# Altium project VeloServo.PrjPcb
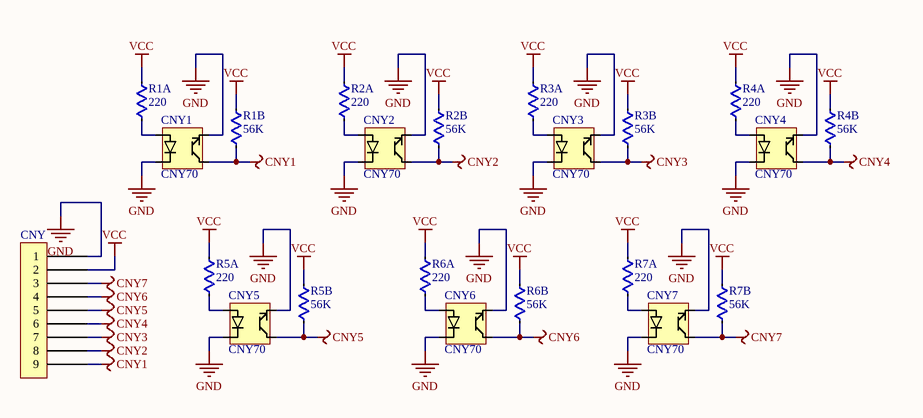
[diagram p0: sensores.SchDoc]
2 sheets, 39 parts. Net scope: global (net labels, ports and power ports of the same name join across sheets).
Board files: sensores.PcbDoc, main.PcbDoc
Sheets:
  sensores.SchDoc
  main.SchDoc

## Sheet sensores.SchDoc
size A4

### Parts
(Parts that share a designator on the sheet are numbered #1, #2 ... from top to bottom, then left to right.)
CNY1  CNY70  [CNY70]
CNY2  CNY70  [CNY70]
CNY3  CNY70  [CNY70]
CNY4  CNY70  [CNY70]
CNY5  CNY70  [CNY70]
CNY6  CNY70  [CNY70]
CNY7  CNY70  [CNY70]
CNY#1  (no value)  [HEADER 1x9]
R1A  value 220  [RES-Axial-400mil]
R1B  value 56K  [RES-Axial-400mil]
R2A  value 220  [RES-Axial-400mil]
R2B  value 56K  [RES-Axial-400mil]
R3A  value 220  [RES-Axial-400mil]
R3B  value 56K  [RES-Axial-400mil]
R4A  value 220  [RES-Axial-400mil]
R4B  value 56K  [RES-Axial-400mil]
R5A  value 220  [RES-Axial-400mil]
R5B  value 56K  [RES-Axial-400mil]
R6A  value 220  [RES-Axial-400mil]
R6B  value 56K  [RES-Axial-400mil]
R7A  value 220  [RES-Axial-400mil]
R7B  value 56K  [RES-Axial-400mil]

### Nets
CNY1: CNY1.C CNY#1.9 R1B.1
CNY2: CNY2.C CNY#1.8 R2B.1
CNY3: CNY3.C CNY#1.7 R3B.1
CNY4: CNY4.C CNY#1.6 R4B.1
CNY5: CNY5.C CNY#1.5 R5B.1
CNY6: CNY6.C CNY#1.4 R6B.1
CNY7: CNY7.C CNY#1.3 R7B.1
GND: CNY1.E(7.5) CNY1.K CNY2.E(7.5) CNY2.K CNY3.E(7.5) CNY3.K CNY4.E(7.5) CNY4.K CNY5.E(7.5) CNY5.K CNY6.E(7.5) CNY6.K CNY7.E(7.5) CNY7.K CNY#1.1
VCC: CNY#1.2 R1A.1 R1B.2 R2A.1 R2B.2 R3A.1 R3B.2 R4A.1 R4B.2 R5A.1 R5B.2 R6A.1 R6B.2 R7A.1 R7B.2
NetCNY1_A: CNY1.A R1A.2
NetCNY2_A: CNY2.A R2A.2
NetCNY3_A: CNY3.A R3A.2
NetCNY4_A: CNY4.A R4A.2
NetCNY5_A: CNY5.A R5A.2
NetCNY6_A: CNY6.A R6A.2
NetCNY7_A: CNY7.A R7A.2

### Library data of the parts
CNY#1 = Header 1x9
R1A R1B R2A R2B R3A R3B R4A R4B R5A R5B R6A R6B R7A R7B = RES

## Sheet main.SchDoc
size A4
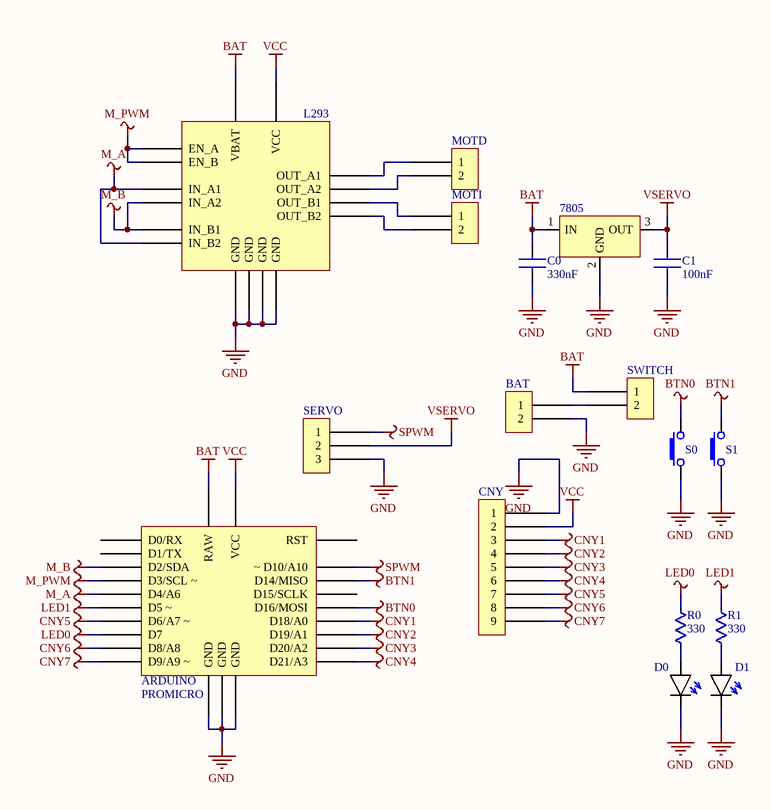
[diagram p1: main.SchDoc]

### Parts
(Parts that share a designator on the sheet are numbered #1, #2 ... from top to bottom, then left to right.)
7805  LM78XX  [TO-220-STRAIGHT]  (value not drawn)
ARDUINO  PROMICRO  [PROMICRO]
BAT  (no value)  [HEADER 1x2]
C0  value 330nF  [CAP-CER]  (hidden comment: CAP-CER)
C1  value 100nF  [CAP-CER]  (hidden comment: CAP-CER)
CNY#2  (no value)  [HEADER 1x9]
D0  LED  [LED-3MM-RED]  (value not drawn)
D1  LED  [LED-3MM-GREEN]  (value not drawn)
L293  L293  [DIP16]  (value not drawn)
MOTD  (no value)  [HEADER 1x2]
MOTI  (no value)  [HEADER 1x2]
R0  value 330  [RES-Axial-400mil]  (hidden comment: RES)
R1  value 330  [RES-Axial-400mil]  (hidden comment: RES)
S0  BUTTON_SMALL_4PIN  [TACT_SWITCH-SMALL-4PIN]  (value not drawn)
S1  BUTTON_SMALL_4PIN  [TACT_SWITCH-SMALL-4PIN]  (value not drawn)
SERVO  (no value)  [Header 1x3]
SWITCH  (no value)  [HEADER 1x2]

### Nets
BAT: 7805.1(IN) ARDUINO.13(RAW) C0.2 L293.16(VBAT) SWITCH.1
BTN0: ARDUINO.23(D16/MOSI) S0.2
BTN1: ARDUINO.22(D14/MISO) S1.2
CNY1: ARDUINO.20(D18/A0) CNY#2.3
CNY2: ARDUINO.19(D19/A1) CNY#2.4
CNY3: ARDUINO.18(D20/A2) CNY#2.5
CNY4: ARDUINO.17(D21/A3) CNY#2.6
CNY5: ARDUINO.4(D6/A7_~) CNY#2.7
CNY6: ARDUINO.2(D8/A8) CNY#2.8
CNY7: ARDUINO.1(D9/A9_~) CNY#2.9
GND: 7805.2(GND) ARDUINO.9(GND) ARDUINO.10(GND) ARDUINO.14(GND) BAT.2 C0.1 C1.2 CNY#2.1 D0.K D1.K L293.4(GND) L293.5(GND) L293.12(GND) L293.13(GND) S0.1 S1.1 SERVO.3
LED0: ARDUINO.3(D7) R0.2
LED1: ARDUINO.5(D5_~) R1.2
M_A: ARDUINO.6(D4/A6) L293.2(IN_A1) L293.15(IN_B2)
M_B: ARDUINO.8(D2/SDA) L293.7(IN_A2) L293.10(IN_B1)
M_PWM: ARDUINO.7(D3/SCL_~) L293.1(EN_A) L293.9(EN_B)
SPWM: ARDUINO.24(~_D10/A10) SERVO.1
VCC: ARDUINO.16(VCC) CNY#2.2 L293.8(VCC)
VSERVO: 7805.3(OUT) C1.1 SERVO.2
NetBAT_1: BAT.1 SWITCH.2
NetD0_A: D0.A R0.1
NetD1_A: D1.A R1.1
NetL293_3: L293.3(OUT_A1) MOTD.1
NetL293_6: L293.6(OUT_A2) MOTD.2
NetL293_11: L293.11(OUT_B1) MOTI.1
NetL293_14: L293.14(OUT_B2) MOTI.2

Not connected (* = marked no-connect by the designer): ARDUINO 11(D0/RX) 12(D1/TX) 15(RST) 21(D15/SCLK)

### Library data of the parts
BAT MOTD MOTI SWITCH = Header 1x2
CNY#2 = Header 1x9
SERVO = Header 1x3

## Nets that join several sheets
CNY1: sensores (CNY1.C CNY#1.9 R1B.1), main (ARDUINO.20 CNY#2.3)
CNY2: sensores (CNY2.C CNY#1.8 R2B.1), main (ARDUINO.19 CNY#2.4)
CNY3: sensores (CNY3.C CNY#1.7 R3B.1), main (ARDUINO.18 CNY#2.5)
CNY4: sensores (CNY4.C CNY#1.6 R4B.1), main (ARDUINO.17 CNY#2.6)
CNY5: sensores (CNY5.C CNY#1.5 R5B.1), main (ARDUINO.4 CNY#2.7)
CNY6: sensores (CNY6.C CNY#1.4 R6B.1), main (ARDUINO.2 CNY#2.8)
CNY7: sensores (CNY7.C CNY#1.3 R7B.1), main (ARDUINO.1 CNY#2.9)
GND: sensores (15 pins), main (17 pins)
VCC: sensores (15 pins), main (ARDUINO.16 CNY#2.2 L293.8)